# EAGLE schematic hamownia (EAGLE 9.3.0)
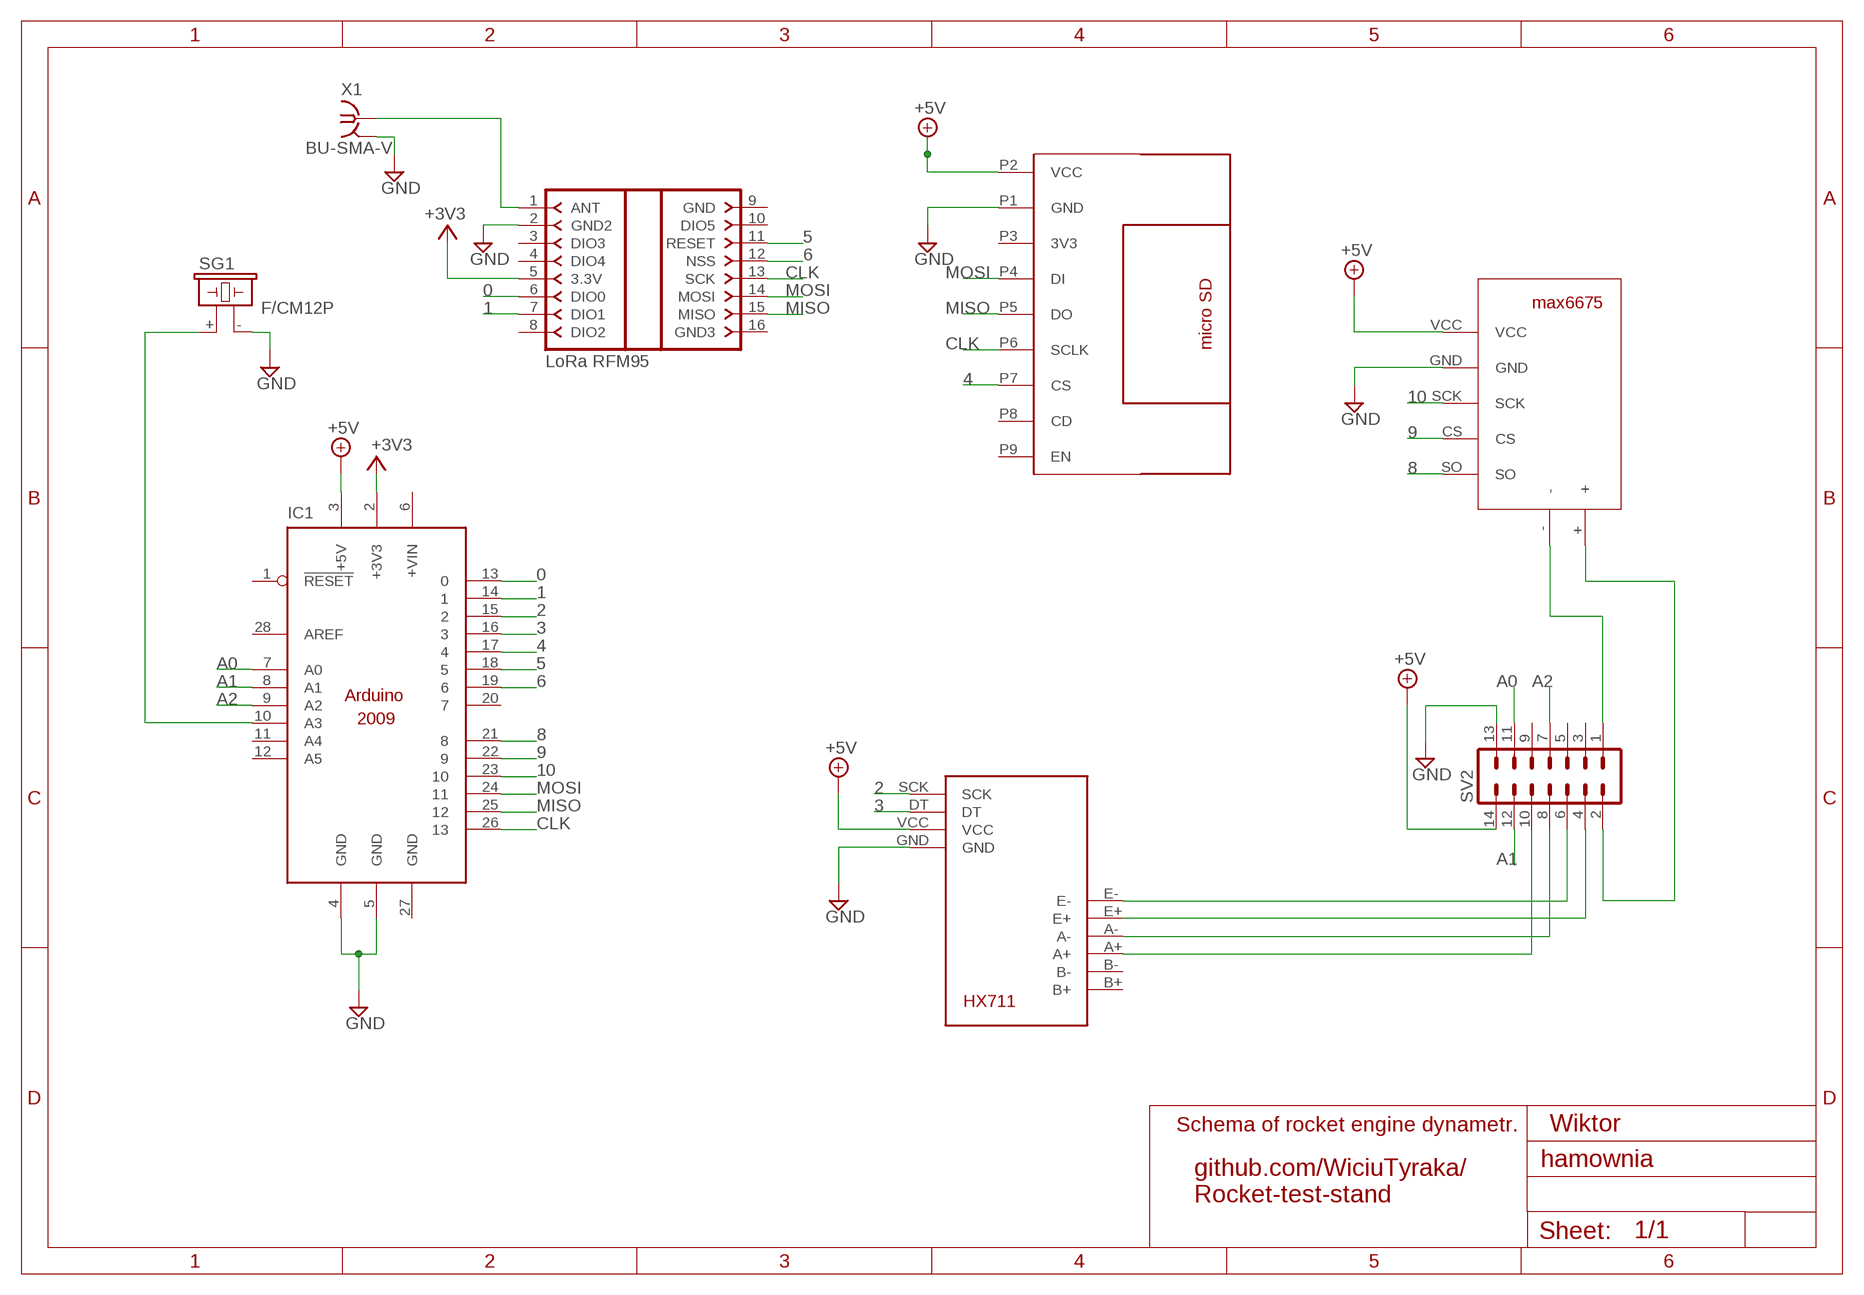
[diagram p0: schematic, sheet 1]

## Parts
IC1  ARDUINO2009_10  [ARDUINO2009]
LORA  LORA_RFM95_ADAPTERLORA_RFM95W  [LORA_RFM95_ADAPTER]
SD1  MICRO_SD  [MICRO_SD]
SG1  F/CM12P  [F/CM12P]
SV2  ML14  [ML14]
U$1  HX711  [HX711]
U$2  MAX6675  [MAX6675_FOOTPRINT]
X1  BU-SMA-V  [BU-SMA-V]

## Nets
0: IC1.13 LORA.6(DIO0)
1: IC1.14 LORA.7(DIO1)
2: IC1.15 U$1.SCK
3: IC1.16 U$1.DT
4: IC1.17 SD1.P7(CS)
5: IC1.18 LORA.11(RESET)
6: IC1.19 LORA.12(NSS)
8: IC1.21 U$2.SO
9: IC1.22 U$2.CS
10: IC1.23 U$2.SCK
+3V3: IC1.2(+3V3) LORA.5(3.3V)
+5V: IC1.3(+5V) SD1.P2(VCC) SV2.14 U$1.VCC U$2.VCC
A0: IC1.7(A0) SV2.11
A1: IC1.8(A1) SV2.12
A2: IC1.9(A2) SV2.7
CLK: IC1.26 LORA.13(SCK) SD1.P6(SCLK)
GND: IC1.4(GND) IC1.5(GND) LORA.2(GND2) SD1.P1(GND) SG1.- SV2.13 U$1.GND U$2.GND X1.2 X1.3 X1.4 X1.5
MISO: IC1.25 LORA.15(MISO) SD1.P5(DO)
MOSI: IC1.24 LORA.14(MOSI) SD1.P4(DI)
N$1: SV2.2 U$2.+
N$2: IC1.10(A3) SG1.+
N$3: SV2.1 U$2.-
N$4: SV2.4 U$1.E+
N$5: SV2.6 U$1.E-
N$6: SV2.8 U$1.A-
N$7: LORA.1(ANT) X1.1
N$12: SV2.10 U$1.A+
Unconnected: IC1.1(!RESET) IC1.6(+VIN) IC1.11(A4) IC1.12(A5) IC1.20 IC1.28(AREF) LORA.3(DIO3) LORA.4(DIO4) LORA.8(DIO2) LORA.9(GND) LORA.10(DIO5) LORA.16(GND3) SD1.P3(3V3) SD1.P8(CD) SD1.P9(EN) SV2.3 SV2.5 SV2.9 U$1.B+ U$1.B-

## Notes on the sheet
- Schema of rocket engine dynametr. | Wiktor
- github.com/WiciuTyraka/
  Rocket-test-stand

## Power pins joined to a net without a drawn wire
GND: IC1.27(GND)

## Library data of the parts
IC1 = arduino:ARDUINO2009_1: The Arduino Duemilanove ("2009") is a microcontroller board based on the ATmega168 or ATmega328. - 14 digital input/output pins (of which 6 can be used as PWM outputs) - 6 analog inputs, a 16 MHz crystal oscillator - USB connection - power jack - ISP header - reset button It contains everything needed to support the microcontroller; simply connect it to a computer with a USB cable or power it with a AC-to-DC adapter or battery to get started http://arduino.cc/en/Main/ArduinoBoardDuemilanove
LORA = 111_LORA:LORA_RFM95_ADAPTER: ESP8266 Adapter for ESP8266-03, ESP8266-04, ESP8266-07, ESP8266-08, ESP8266-12 and similar. (c) by Bartosz Batorek obi--wan@wp.pl
SD1 = 111_microsd:MICRO_SD
SG1 = buzzer:F/CM12P: BUZZER Source: Buerklin; OC_FARNELL: unknown; OC_NEWARK: unknown
SV2 = con-harting-ml:ML14: HARTING; OC_FARNELL: unknown; OC_NEWARK: unknown
U$1 = 111_hx711:HX711
U$2 = 111_max6675:MAX6675
X1 = con-coax:BU-SMA-V: FEMALE SMA CONNECTOR Radiall distributor RS 112-3794; OC_FARNELL: unknown; OC_NEWARK: unknown